# EAGLE design SHO-V1.1 (EAGLE 6.4)
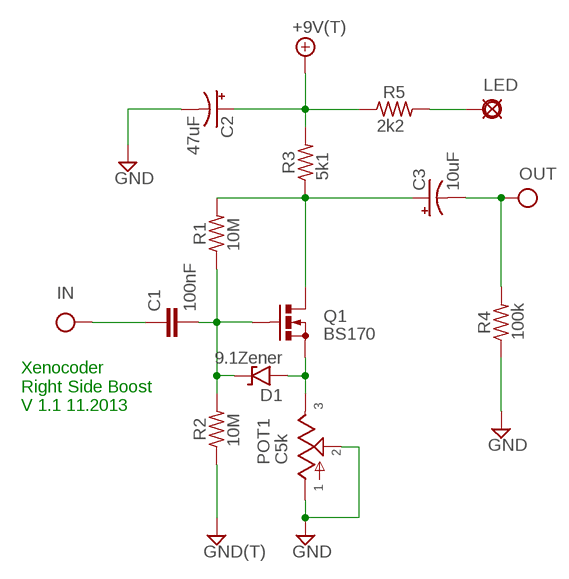
[diagram p0: schematic, sheet 1]

## Parts
+9V  +9V(T)  [SQUARE]
C1  100nF  075X0302  [075X030]
C2  47uF  0631  [063_025]
C3  10uF  0631  [063_025]
D1  9.1Zener  1N9ZENER  [DO35-3]
GND  GND(T)  [SQUARE]
IN  IN(T)  [SQUARE]
LED  3mm  PAD  [SQUARE]
OUT  OUT(T)  [SQUARE]
POT1  C5k  POT16MM_PCB_PADS  [16MM_PCB_PADS]
Q1  BS170  [SOT54ES]
R1  10M  6MM.3  [R0207/3]
R2  10M  6MM.3  [R0207/3]
R3  5k1  6MM.3  [R0207/3]
R4  100k  6MM.3  [R0207/3]
R5  2k2  6MM.3  [R0207/3]

## Nets
+9V: +9V.1(+9V) C2.+ R3.2 R5.1
GND: C2.- GND.1(GND) POT1.1 POT1.2 R2.1 R4.1
IN: C1.1 IN.1(IN)
N$1: C3.+ Q1.D R1.2 R3.1
N$2: D1.A POT1.3 Q1.S
N$3: C1.2 D1.C Q1.G R1.1 R2.2
N$4: LED.1(PAD) R5.2
OUT: C3.- OUT.1(OUT) R4.2

## Notes on the sheet
- Xenocoder
  Right Side Boost
  V 1.1 11.2013

## Library data of the parts
+9V = mb_supply:+9V(T): +9V Voltage Supply use this to hook up +9v throughout a schematic instead of running wire automatically labels the net "+9v" adds a hookup pad to the circuit board
C1 = mb_caps-chicklet:075X030: 0.015 - 0.022uF Panasonic ECQ-B 7.5mm x 3mm 50 or 63V: 0.015 - 0.022uF;
C2 C3 = mb_caps-electro:063: 33 - 220uF Xicon values at Mouser.com 10V: 220uF; 16V: 100uF; 25V: 100uF; 50V: 33uF
D1 = mb_diodes:1N9*ZENER: 1N9???B Zener Diode DO-35 case 1N957B - 1N992B (6.8V to 200V)
GND = mb_supply:GND(T): Ground use this to hook up ground (GND) throughout a schematic instead of running wire automatically labels the net "GND" adds a hookup pad to the circuit board (you can use several)
IN = mb_supply:IN(T): Input obsolete: use Pad instead and label net shematic input label with circuit board terminal/pad generally used only once on a schematic (because this device labels the net "IN" in the same way as a voltage supply or ground net)
LED = mb_supply:PAD: PAD use this package for pads with any purpose, including input, output, send or return various pad shapes: round, square, octogonal, long, and long offset
OUT = mb_supply:OUT(T): Output obsolete: use Pad instead and label net output label with circuit board terminal/pad usually appears only once on a schematic
POT1 = mb_pots:POT: Potentiometers the arrow indicates the clockwise motion of th wiper (lug 2) fully counter clockwise there is no resistance between lugs 1 and 2 fully clockwise the resistance between lugs 1 and 2 is the value of the pot
Q1 = mb_trans:BS170: N-CHANNEL MOS FET
R1-R5 = mb_resistors:6MM: 6mm Resistors Leads spaced 1-6 holes apart for 0.1" perfboard. Suitable for 1/4 watt resistors.

## Board
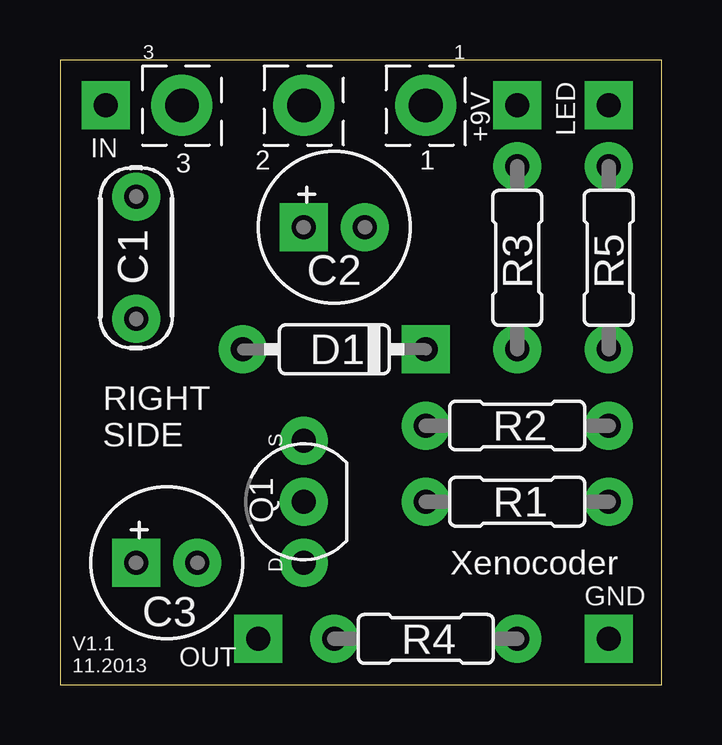
[diagram p1: board, top side]
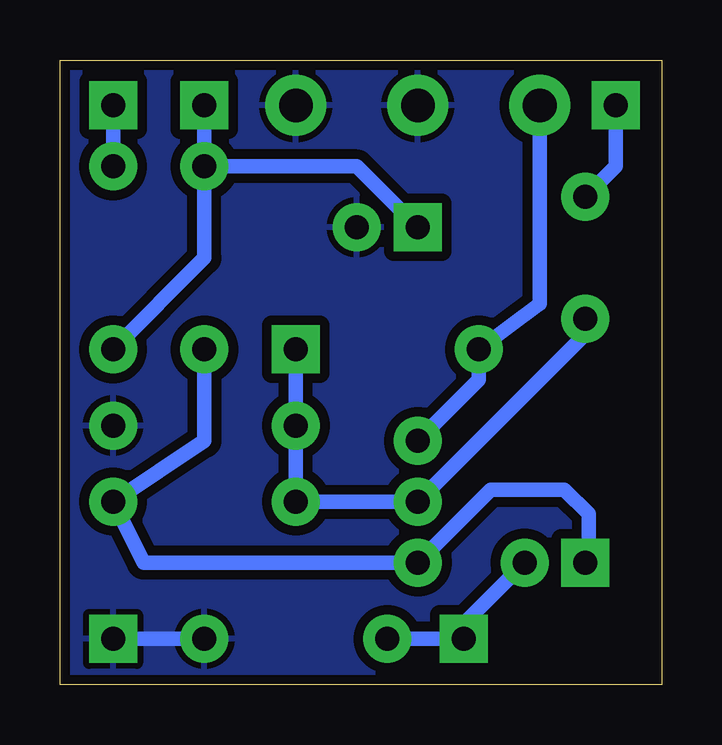
[diagram p2: board, bottom side, seen from below]

Size 25.07 x 26.02 mm. Coordinates in mm from the lower left corner, seen from the top.
Outline: 0,0 25.07,0 25.07,26.02 0,26.02 0,0
Copper layers (1*16): Top 0.0356mm / dielectric 1.5011mm / Bottom 0.0356mm
Design rules "LaenPCBOrder": minimum track width 6mil, minimum drill 13mil, track to track 6mil, track to pad 6mil, pad to pad 6mil, via to via 6mil, smd to smd 6mil, copper to edge 15mil, drill to drill 6mil, minimum pad ring 7mil, minimum via ring 7mil, stop-mask expansion 3mil, vias tented up to drill 0mil, thermal gap 10mil

### Footprints (pad centres in the part's own frame; a part is rotated, then mirrored left to right if it is on the bottom)
SQUARE = drill 1 pad 2 square: 1 0,0
075X030 = drill 1 pad 2: 1 -2.54,0; 2 2.54,0
063_025 = drill 1 pad 2 square: + -1.27,0 | drill 1 pad 2: - 1.27,0
DO35-3 = drill 1 pad 2: A 3.81,0 | drill 1 pad 2 square: C -3.81,0
16MM_PCB_PADS = drill 1.4 pad 2.54: 1 5.08,0; 2 0,0; 3 -5.08,0
SOT54ES = drill 1 pad 2: D -2.54,0; G 0,0; S 2.54,0
R0207/3 = drill 1 pad 2: 1 -3.81,0; 2 3.81,0

### Placement (x,y rotation side)
+9V  19.05,24.13 0 top
C1  3.17,17.78 270 top
C2  11.43,19.05 0 top
C3  4.45,5.08 0 top
D1  11.43,13.97 180 top
GND  22.86,1.91 0 top
IN  1.91,24.13 0 top
LED  22.86,24.13 0 top
OUT  8.26,1.91 0 top
POT1  10.16,24.13 0 top
Q1  10.16,7.62 90 top
R1  19.05,7.62 0 top
R2  19.05,10.79 180 top
R3  19.05,17.78 90 top
R4  15.24,1.91 180 top
R5  22.86,17.78 90 top

### Tracks (layer width: path | path; a pad name or v marks a point on that pad's centre or on a via)
+9V
  Bottom 0.61: R3.2 +9V.1 | R5.1 19.05,17.78 R3.2 | C2.+ 12.7,21.59 R3.2
GND
  Bottom 0.61: R4.1 GND.1
  pour Bottom (isolate 0.406): 0.25,25.65 24.89,25.65 24.89,0.25 0.25,0.25
IN
  Bottom 0.61: C1.1 1.91,21.59 IN.1
N$1
  Bottom 0.61: R3.1 19.05,10.16 R1.2 21.59,5.08 Q1.D 7.11,8.13 4.06,8.13 3.05,7.11 3.05,5.21 C3.+
N$2
  Bottom 0.61: Q1.S 7.62,12.7 D1.A 5.08,15.88 POT1.3
N$3
  Bottom 0.61: C1.2 3.17,14.61 Q1.G R1.1 R2.2 D1.C
N$4
  Bottom 0.61: R5.2 LED.1
OUT
  Bottom 0.61: R4.2 OUT.1 8.26,2.54 C3.-

### Text on the board
tPlace: 3 | 2 | 1 | RIGHT / SIDE | Xenocoder | V1.1 / 11.2013